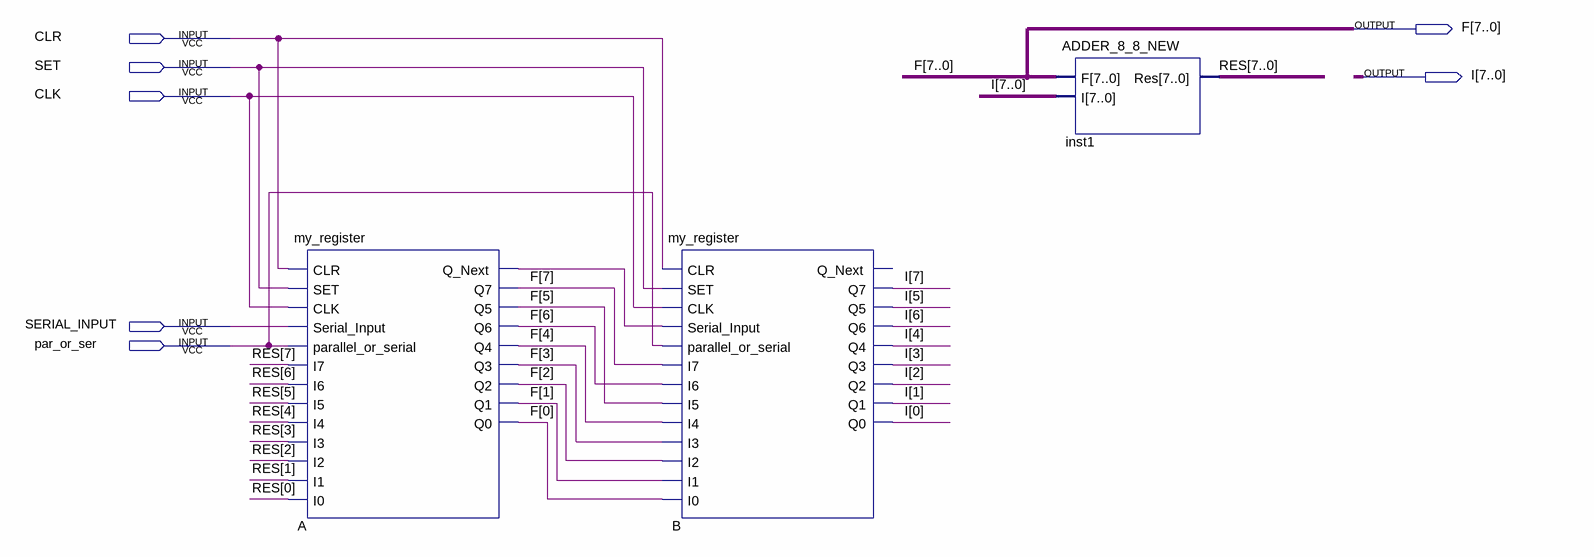
[diagram p0: schematic sheet]
// Quartus schematic Fibonacci.bdf as structural Verilog: 3 symbols, 7 pins
module Fibonacci (
  input  CLR,
  input  SET,
  input  CLK,
  input  SERIAL_INPUT,
  input  par_or_ser,
  output [7:0] F,
  output [7:0] I
);

  wire A_q_next;
  wire [7:0] RES;

  my_register A (
    .CLR(CLR), .SET(SET), .CLK(CLK), .Serial_Input(SERIAL_INPUT), .parallel_or_serial(par_or_ser),
    .I7(RES[7]), .I6(RES[6]), .I5(RES[5]), .I4(RES[4]), .I3(RES[3]), .I2(RES[2]), .I1(RES[1]), .I0(RES[0]),
    .Q_Next(A_q_next), .Q7(F[7]), .Q5(F[5]), .Q6(F[6]), .Q4(F[4]), .Q3(F[3]), .Q2(F[2]), .Q1(F[1]), .Q0(F[0]));
  my_register B (
    .CLR(CLR), .SET(SET), .CLK(CLK), .Serial_Input(A_q_next), .parallel_or_serial(par_or_ser), .I7(F[7]),
    .I6(F[6]), .I5(F[5]), .I4(F[4]), .I3(F[3]), .I2(F[2]), .I1(F[1]), .I0(F[0]), .Q7(I[7]), .Q5(I[5]),
    .Q6(I[6]), .Q4(I[4]), .Q3(I[3]), .Q2(I[2]), .Q1(I[1]), .Q0(I[0]));  // open: Q_Next
  ADDER_8_8_NEW inst1 (.F(F), .I(I), .Res(RES));
endmodule
